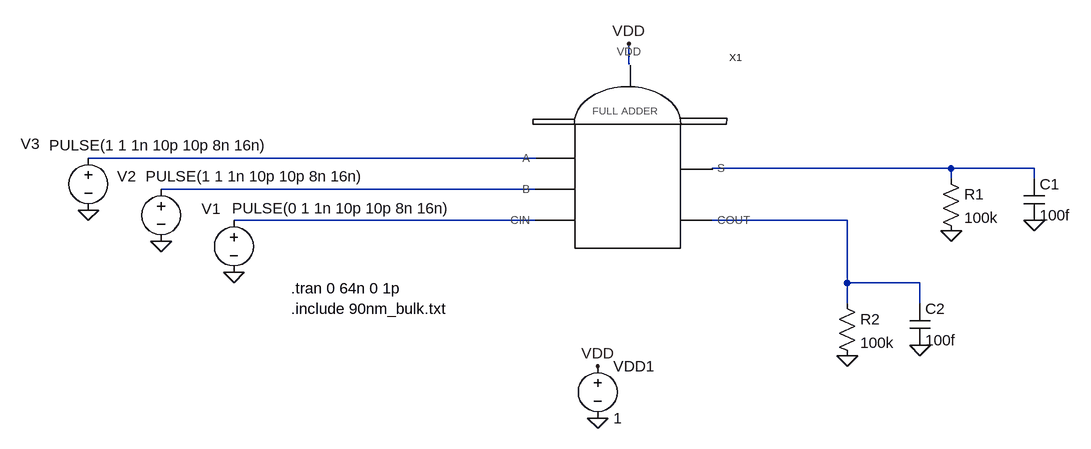
[diagram p0: schematic ADDER_test.asc]
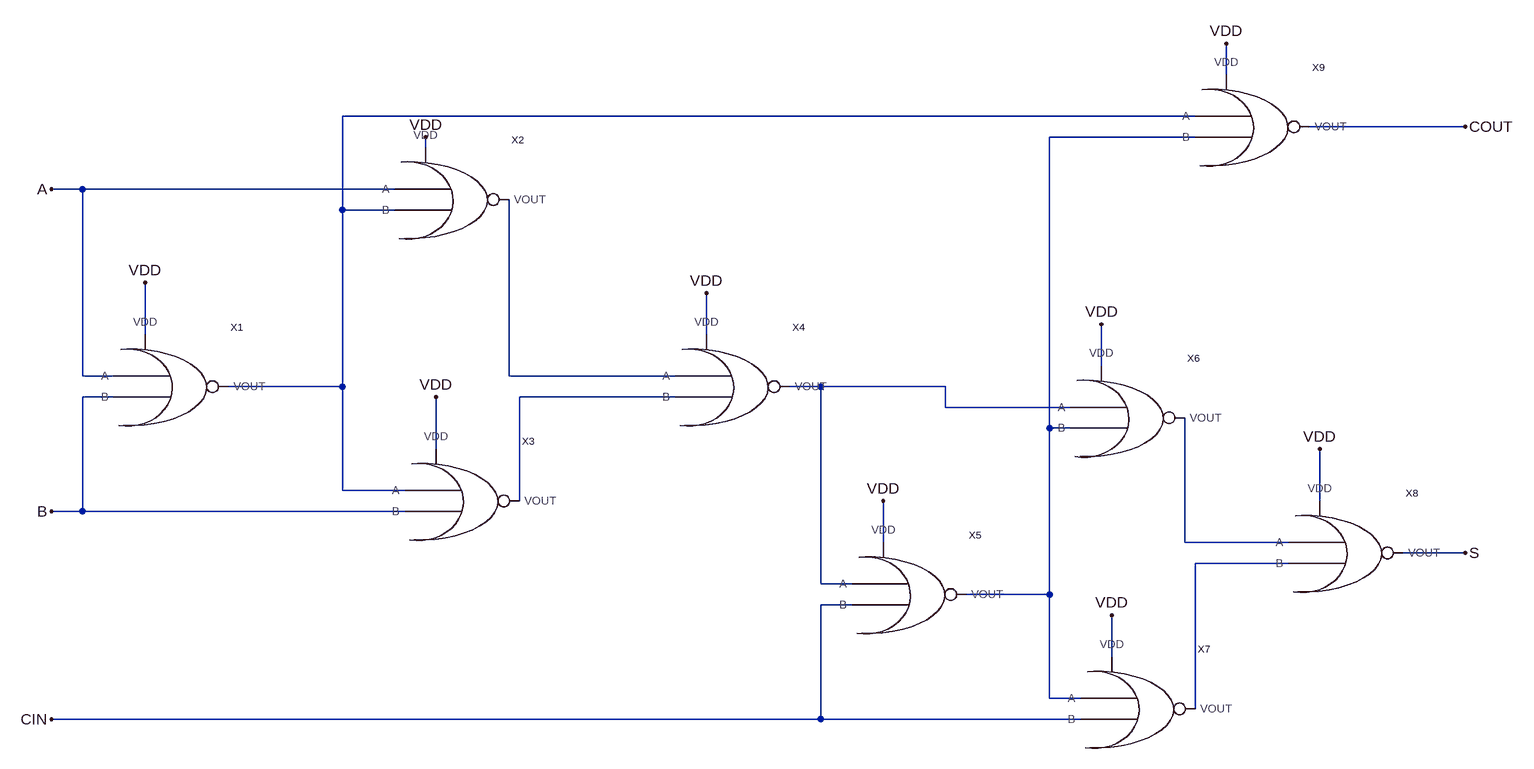
[diagram p1: sub-circuit adder.asc]
ADDER_test.asc, the LTspice schematic file:
Version 4
SHEET 1 880 680
WIRE 192 -64 192 -96
WIRE 48 80 -640 80
WIRE 688 96 320 96
WIRE 816 96 688 96
WIRE 688 112 688 96
WIRE 816 112 816 96
WIRE 48 128 -528 128
WIRE 48 176 -416 176
WIRE 528 176 320 176
WIRE 528 272 528 176
WIRE 640 272 528 272
WIRE 528 304 528 272
WIRE 640 304 640 272
FLAG 528 384 0
FLAG 640 368 0
FLAG 688 192 0
FLAG 816 176 0
FLAG -640 160 0
FLAG -528 208 0
FLAG -416 256 0
FLAG 144 480 0
FLAG 144 400 VDD
FLAG 192 -96 VDD
SYMBOL ADDER 192 128 R0
SYMATTR InstName X1
SYMBOL res 672 96 R0
SYMATTR InstName R1
SYMATTR Value 100k
SYMBOL res 512 288 R0
SYMATTR InstName R2
SYMATTR Value 100k
SYMBOL cap 800 112 R0
SYMATTR InstName C1
SYMATTR Value 100f
SYMBOL cap 624 304 R0
SYMATTR InstName C2
SYMATTR Value 100f
SYMBOL voltage -416 160 R0
WINDOW 0 -50 -2 Left 2
WINDOW 3 -3 -3 Left 2
WINDOW 123 0 0 Left 0
WINDOW 39 0 0 Left 0
SYMATTR InstName V1
SYMATTR Value PULSE(0 1 1n 10p 10p 8n 16n)
SYMBOL voltage -528 112 R0
WINDOW 0 -68 -4 Left 2
WINDOW 3 -24 -4 Left 2
WINDOW 123 0 0 Left 0
WINDOW 39 0 0 Left 0
SYMATTR InstName V2
SYMATTR Value PULSE(1 1 1n 10p 10p 8n 16n)
SYMBOL voltage -640 64 R0
WINDOW 0 -104 -6 Left 2
WINDOW 3 -60 -4 Left 2
WINDOW 123 0 0 Left 0
WINDOW 39 0 0 Left 0
SYMATTR InstName V3
SYMATTR Value PULSE(1 1 1n 10p 10p 8n 16n)
SYMBOL voltage 144 384 R0
WINDOW 123 0 0 Left 0
WINDOW 39 0 0 Left 0
SYMATTR InstName VDD1
SYMATTR Value 1
TEXT -328 280 Left 2 !.tran 0 64n 0 1p
TEXT -328 312 Left 2 !.include 90nm_bulk.txt

adder.asc, the sub-circuit schematic file:
Version 4
SHEET 1 1864 832
WIRE 1408 -240 1408 -288
WIRE 1360 -176 48 -176
WIRE 1776 -160 1536 -160
WIRE 1360 -144 1136 -144
WIRE 176 -128 176 -144
WIRE -352 -64 -400 -64
WIRE 128 -64 -352 -64
WIRE 48 -32 48 -176
WIRE 128 -32 48 -32
WIRE -256 160 -256 80
WIRE 608 160 608 96
WIRE 1216 208 1216 144
WIRE -352 224 -352 -64
WIRE -304 224 -352 224
WIRE 304 224 304 -48
WIRE 560 224 304 224
WIRE 48 240 48 -32
WIRE 48 240 -128 240
WIRE 784 240 736 240
WIRE 976 240 784 240
WIRE -304 256 -352 256
WIRE 560 256 320 256
WIRE 976 272 976 240
WIRE 1168 272 976 272
WIRE 1136 304 1136 -144
WIRE 1168 304 1136 304
WIRE 192 336 192 256
WIRE 48 400 48 240
WIRE 144 400 48 400
WIRE 320 416 320 256
WIRE 1552 416 1552 336
WIRE -352 432 -352 256
WIRE -352 432 -400 432
WIRE 144 432 -352 432
WIRE 880 480 880 416
WIRE 1344 480 1344 288
WIRE 1504 480 1344 480
WIRE 1776 496 1680 496
WIRE 1504 512 1360 512
WIRE 784 544 784 240
WIRE 832 544 784 544
WIRE 1136 560 1136 304
WIRE 1136 560 1008 560
WIRE 832 576 784 576
WIRE 1232 656 1232 592
WIRE 1136 720 1136 560
WIRE 1184 720 1136 720
WIRE 1360 736 1360 512
WIRE 784 752 784 576
WIRE 784 752 -400 752
WIRE 1184 752 784 752
FLAG -256 80 VDD
FLAG 608 96 VDD
FLAG 176 -144 VDD
FLAG 192 256 VDD
FLAG 880 416 VDD
FLAG 1216 144 VDD
FLAG 1408 -288 VDD
FLAG 1552 336 VDD
FLAG 1232 592 VDD
FLAG 1776 496 S
FLAG 1776 -160 COUT
FLAG -400 -64 A
FLAG -400 432 B
FLAG -400 752 CIN
SYMBOL NOR -304 240 R0
SYMATTR InstName X1
SYMBOL NOR 128 -48 R0
SYMATTR InstName X2
SYMBOL NOR 144 416 R0
SYMATTR InstName X3
SYMBOL NOR 560 240 R0
SYMATTR InstName X4
SYMBOL NOR 832 560 R0
SYMATTR InstName X5
SYMBOL NOR 1168 288 R0
SYMATTR InstName X6
SYMBOL NOR 1184 736 R0
SYMATTR InstName X7
SYMBOL NOR 1504 496 R0
SYMATTR InstName X8
SYMBOL NOR 1360 -160 R0
SYMATTR InstName X9

The netlist it stands for:
* ADDER_test.asc
XX1 N001 N003 N004 N005 N002 VDD adder
R1 N002 0 100k
R2 N005 0 100k
C1 N002 0 100f
C2 N005 0 100f
V1 N004 0 PULSE(0 1 1n 10p 10p 8n 16n)
V2 N003 0 PULSE(1 1 1n 10p 10p 8n 16n)
V3 N001 0 PULSE(1 1 1n 10p 10p 8n 16n)
VDD1 VDD 0 1

* block symbol definitions
.subckt adder A B CIN COUT S VDD
XX1 A B N001 VDD NOR  ; pins A B VOUT VDD
XX2 A N001 N003 VDD NOR  ; pins A B VOUT VDD
XX3 N001 B N005 VDD NOR  ; pins A B VOUT VDD
XX4 N003 N005 N004 VDD NOR  ; pins A B VOUT VDD
XX5 N004 CIN N002 VDD NOR  ; pins A B VOUT VDD
XX6 N004 N002 N006 VDD NOR  ; pins A B VOUT VDD
XX7 N002 CIN N007 VDD NOR  ; pins A B VOUT VDD
XX8 N006 N007 S VDD NOR  ; pins A B VOUT VDD
XX9 N001 N002 COUT VDD NOR  ; pins A B VOUT VDD
.ends adder

.tran 0 64n 0 1p
.include 90nm_bulk.txt
.backanno
.end